# EAGLE schematic adapter (EAGLE 7.1.0)
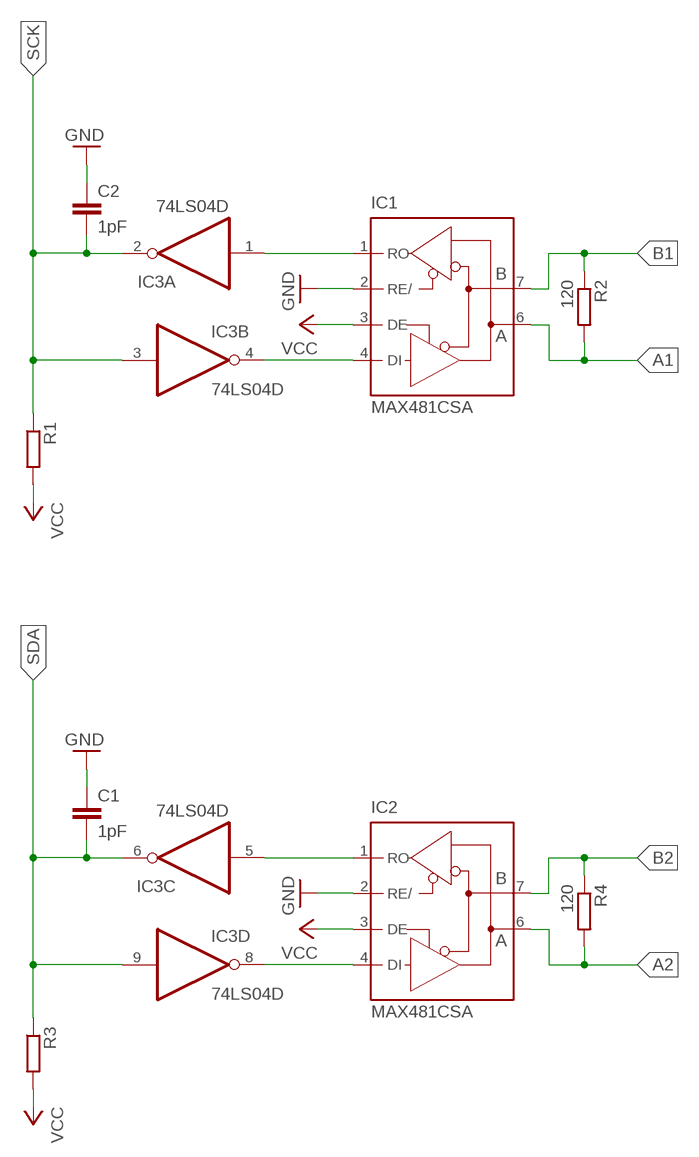
[diagram p0: schematic, sheet 1]

## Parts
C1  1pF  C  [C0805]
C2  1pF  C  [C0805]
IC1  MAX481CSA  [SO08]
IC2  MAX481CSA  [SO08]
IC3  74LS04D  [SO14]
R1  R0204/7  [0204/7]
R2  120  R0204/7  [0204/7]
R3  R0204/7  [0204/7]
R4  120  R0204/7  [0204/7]

## Nets
A1: IC1.6(A) R2.2
A2: IC2.6(A) R4.2
B1: IC1.7(B) R2.1
B2: IC2.7(B) R4.1
GND: C1.1 C2.1 IC1.2(RE/) IC2.2(RE/)
N$1: IC1.4(DI) IC3.4(B:O)
N$2: IC1.1(RO) IC3.1(A:I)
N$3: IC2.1(RO) IC3.5(C:I)
N$4: IC2.4(DI) IC3.8(D:O)
SCK: C2.2 IC3.2(A:O) IC3.3(B:I) R1.1
SDA: C1.2 IC3.6(C:O) IC3.9(D:I) R3.1
VCC: IC1.3(DE) IC2.3(DE) R1.2 R3.2
Unconnected: IC3.10(E:O) IC3.11(E:I) IC3.12(F:O) IC3.13(F:I)

## Power pins joined to a net without a drawn wire
GND: IC1.5(GND) IC2.5(GND) IC3.7(P:GND)
VCC: IC1.8(VCC) IC2.8(VCC) IC3.14(P:VCC)

## Library data of the parts
C1 C2 = eagle-ltspice:C: CAPACITOR, European symbol; SPICEMODEL: NONE; SPICEPREFIX: C
IC1 IC2 = maxim:MAX481CSA: RS485 TRANSEIVER
IC3 = 74xx-eu:74*04: Hex INVERTER
R1-R4 = eagle-ltspice:R: RESISTOR, European symbol; SPICEMODEL: NONE; SPICEPREFIX: R